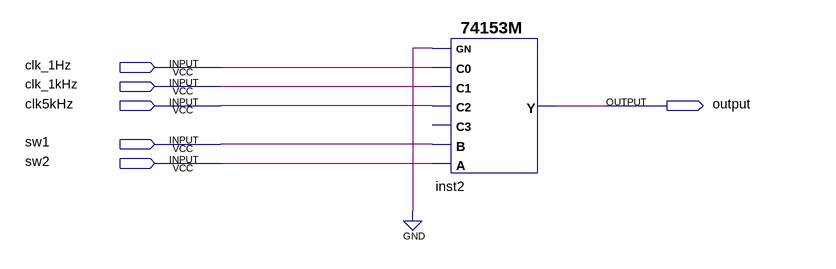
[diagram p0: schematic sheet]
// Quartus schematic spead_select.bdf as structural Verilog: 1 symbols, 6 pins
module spead_select (
  input  clk_1Hz,
  input  clk_1kHz,
  input  clk5kHz,
  input  sw1,
  input  sw2,
  output \output 
);

  \74153M  inst2 (.A(sw2), .B(sw1), .C2(clk5kHz), .C1(clk_1kHz), .C0(clk_1Hz), .GN(1'b0), .Y(\output ));  // open: C3
endmodule
